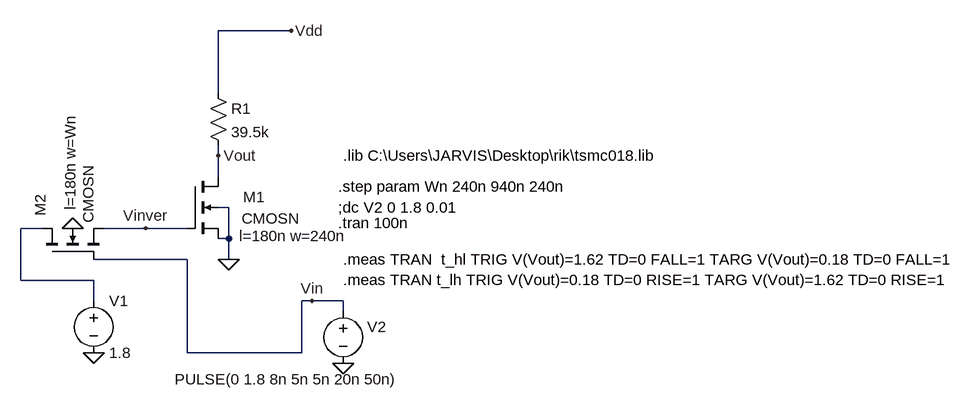
[diagram p0: schematic Draft1.asc]
Draft1.asc, the LTspice schematic file:
Version 4
SHEET 1 1468 680
WIRE 384 -96 272 -96
WIRE 272 0 272 -96
WIRE 272 96 272 80
WIRE 272 128 272 96
WIRE 288 176 272 176
WIRE 0 208 -32 208
WIRE 160 208 96 208
WIRE 224 208 160 208
WIRE 288 224 288 176
WIRE 288 224 272 224
WIRE 224 256 80 256
WIRE 288 256 288 224
WIRE -32 288 -32 208
WIRE 80 288 -32 288
WIRE 80 320 80 288
WIRE 416 320 400 320
WIRE 464 320 416 320
WIRE 464 336 464 320
WIRE 224 400 224 256
WIRE 400 400 400 320
WIRE 400 400 224 400
FLAG 288 256 0
FLAG 48 208 0
FLAG 384 -96 Vdd
FLAG 80 400 0
FLAG 464 416 0
FLAG 272 96 Vout
FLAG 160 208 Vinver
FLAG 416 320 Vin
SYMBOL nmos4 224 128 R0
WINDOW 0 86 32 Left 2
WINDOW 3 84 65 Left 2
WINDOW 123 80 92 Left 2
SYMATTR InstName M1
SYMATTR Value CMOSN
SYMATTR Value2 l=180n w=240n
SYMBOL nmos4 0 256 R270
WINDOW 0 66 -2 Left 2
WINDOW 123 76 44 Left 2
SYMATTR InstName M2
SYMATTR Value2 l=180n w=Wn
SYMATTR Value CMOSN
SYMBOL voltage 80 304 R0
WINDOW 123 0 0 Left 0
WINDOW 39 0 0 Left 0
SYMATTR InstName V1
SYMATTR Value 1.8
SYMBOL res 256 -16 R0
SYMATTR InstName R1
SYMATTR Value 39.5k
SYMBOL voltage 464 320 R0
WINDOW 0 37 40 Left 2
WINDOW 3 -259 121 Left 2
WINDOW 123 0 0 Left 0
WINDOW 39 0 0 Left 0
SYMATTR InstName V2
SYMATTR Value PULSE(0 1.8 8n 5n 5n 20n 50n)
TEXT 456 144 Left 2 !.step param Wn 240n 940n 240n
TEXT 456 176 Left 2 !;dc V2 0 1.8 0.01
TEXT 464 96 Left 2 !.lib C:\\Users\\JARVIS\\Desktop\\rik\\tsmc018.lib
TEXT 456 200 Left 2 !.tran 100n
TEXT 464 256 Left 2 !.meas TRAN  t_hl TRIG V(Vout)=1.62 TD=0 FALL=1 TARG V(Vout)=0.18 TD=0 FALL=1\n.meas TRAN t_lh TRIG V(Vout)=0.18 TD=0 RISE=1 TARG V(Vout)=1.62 TD=0 RISE=1

The netlist it stands for:
* Draft1.asc
M1 Vout Vinver 0 0 CMOSN l=180n w=240n
M2 N001 Vin Vinver 0 CMOSN l=180n w=Wn
V1 N001 0 1.8
R1 Vdd Vout 39.5k
V2 Vin 0 PULSE(0 1.8 8n 5n 5n 20n 50n)
.model NMOS NMOS
.model PMOS PMOS
.lib standard.mos
.step param Wn 240n 940n 240n
;dc V2 0 1.8 0.01
.lib C:\Users\JARVIS\Desktop\rik\tsmc018.lib
.tran 100n
.meas TRAN  t_hl TRIG V(Vout)=1.62 TD=0 FALL=1 TARG V(Vout)=0.18 TD=0 FALL=1
.meas TRAN t_lh TRIG V(Vout)=0.18 TD=0 RISE=1 TARG V(Vout)=1.62 TD=0 RISE=1
.backanno
.end

* Results of the author's LTspice run, read from the files saved beside the schematic
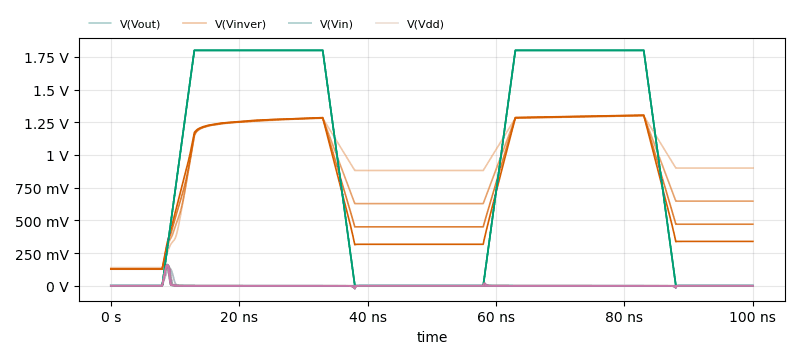
[diagram p1: Transient Analysis of Draft1.asc, plotted from the saved traces]
* Transient Analysis, 4 runs:
*   V(Vout) [wn=2.4e-07]: min -98.46 µV, max 131.3 mV, average 1.72 mV, rms 12.98 mV, last 0 V
*   V(Vout) [wn=4.8e-07]: min -373.7 µV, max 155.3 mV, average 1.516 mV, rms 13.24 mV, last 0 V
*   V(Vout) [wn=7.2e-07]: min -2.7 mV, max 161.1 mV, average 1.346 mV, rms 12.77 mV, last 0 V
*   V(Vout) [wn=9.4e-07]: min -23.3 mV, max 161.4 mV, average 1.163 mV, rms 12.47 mV, last -32.64 nV
*   V(Vinver) [wn=2.4e-07]: min 138.2 mV, max 1.3 V, average 994.3 mV, rms 1.05 V, last 900 mV
*   V(Vinver) [wn=4.8e-07]: min 126.9 mV, max 1.301 V, average 895.4 mV, rms 972.4 mV, last 646.9 mV
*   V(Vinver) [wn=7.2e-07]: min 126.6 mV, max 1.303 V, average 828.6 mV, rms 930.9 mV, last 470.6 mV
*   V(Vinver) [wn=9.4e-07]: min 128.2 mV, max 1.305 V, average 780.1 mV, rms 908.6 mV, last 339.2 mV
*   V(Vin) [wn=2.4e-07]: min 0 V, max 1.8 V, average 900 mV, rms 1.243 V, last 0 V
*   V(Vin) [wn=4.8e-07]: min 0 V, max 1.8 V, average 900 mV, rms 1.237 V, last 0 V
*   V(Vin) [wn=7.2e-07]: min 0 V, max 1.8 V, average 900 mV, rms 1.232 V, last 0 V
*   V(Vin) [wn=9.4e-07]: min 0 V, max 1.8 V, average 900 mV, rms 1.231 V, last 0 V
*   V(Vdd) [wn=2.4e-07]: min -98.46 µV, max 131.3 mV, average 1.72 mV, rms 12.98 mV, last 0 V
*   V(Vdd) [wn=4.8e-07]: min -373.7 µV, max 155.3 mV, average 1.516 mV, rms 13.24 mV, last 0 V
*   V(Vdd) [wn=7.2e-07]: min -2.7 mV, max 161.1 mV, average 1.346 mV, rms 12.77 mV, last 0 V
*   V(Vdd) [wn=9.4e-07]: min -23.3 mV, max 161.4 mV, average 1.163 mV, rms 12.47 mV, last -32.64 nV
* From the log:
*   Measurement "t_hl" FAIL'ed
*   Measurement "t_lh" FAIL'ed